# Altium schematic sheet 3 buck.SchDoc
size A4; SheetNumber: 3; SheetTotal: 13
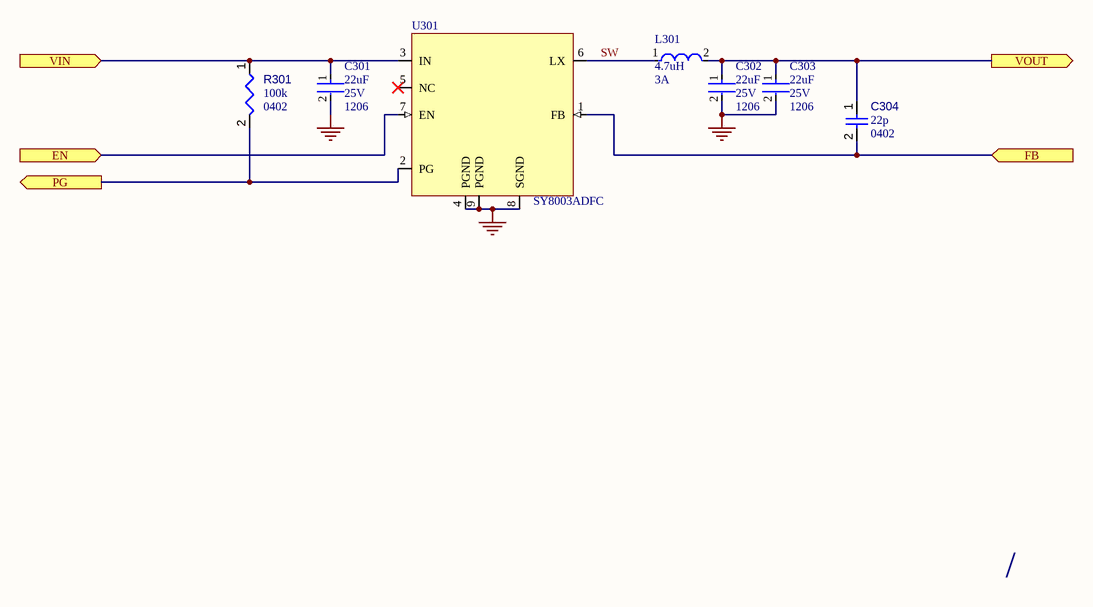
[diagram p0: 3 buck.SchDoc]

## Parts
C301  Capacitance: 22uF  Voltage Rating (DC): 25V  Case Code (Imperial): 1206  [FP-1206-L_3_2_0_3-W_1_6_0-MFG]  (hidden comment: TMK316BBJ226ML-T)
C302  Capacitance: 22uF  Voltage Rating (DC): 25V  Case Code (Imperial): 1206  [FP-1206-L_3_2_0_3-W_1_6_0-MFG]  (hidden comment: TMK316BBJ226ML-T)
C303  Capacitance: 22uF  Voltage Rating (DC): 25V  Case Code (Imperial): 1206  [FP-1206-L_3_2_0_3-W_1_6_0-MFG]  (hidden comment: TMK316BBJ226ML-T)
C304  value 22p  Case/Package: 0402  [CAPC0402(1005)60_L]  (hidden comment: Capacitors,0402,22p)
L301  Inductance: 4.7uH  Current Rating: 3A  [FP-IHLP-2525AH-FP_2_413x3-MFG]  (hidden comment: IHLP2525AHER4R7M01)
R301  value 100k  Case/Package: 0402  [RESC0402(1005)_L]  (hidden comment: Resistors,0402,1%,100k)
U301  SY8003ADFC  [DFN2x2-8]

## Ports
EN (in), FB (in), PG (out), VIN (in), VOUT (out)

## Nets
GND: C301.2 C302.2 C303.2 U301.4(PGND) U301.8(SGND) U301.9(PGND)
EN: U301.7(EN) ; port EN
FB: C304.2 U301.1(FB) ; port FB
PG: R301.2 U301.2(PG) ; port PG
SW: L301.1 U301.6(LX)
VIN: C301.1 R301.1 U301.3(IN) ; port VIN
VOUT: C302.1 C303.1 C304.1 L301.2 ; port VOUT

Not connected (* = marked no-connect by the designer): U301 5(NC)*

## Notes on the sheet
- /

## Library data of the parts
C301-C303 = CMP-14477-000100-2: None; Tolerance: 20%; Dielectric: X5R; Resistor Type: Ceramic; Length: 3.2mm; RoHS Compliant: Yes; Case Code (Metric): 3216; Halogen Free: Halogen Free; Series: M; Termination: SMD/SMT; Voltage Rating: 25V; Packaging: Tape and Reel; Width: 0.063inch; Height: 1.6mm; Thickness: 0.075inch; Min Operating Temperature: -55°C; Case/Package: 1206; Mount: Surface Mount; Max Operating Temperature: 85°C; Weight: 0.000571oz; Construction: Flat; Package Quantity: 2000
C304 = Capacitors: Capacitor; Component Type: Capacitors
L301 = CMP-02424-000390-1: Commercial Inductors, High Saturation Series 4.7uH 3A 78mΩ 20%; Test Frequency: 100kHz; DC Resistance (DCR): 78mR; Saturation Current: 8A; Core Material: Metal; Shielding: Shielded; Self Resonant Frequency: 5MHz; Packaging: Tape and Reel; Height: 1.8mm; Case/Package: 2525; Mount: Surface Mount; Min Operating Temperature: -55°C; Package Quantity: 2000; RMS Current (Irms): 3A; Radiation Hardening: No; Termination: SMD/SMT; Length: 6.86mm; Military Standard: Not; Max DC Current: 8A; Depth: 6.72mm; Height - Seated (Max): 0.071inch; Tolerance: 20%; Lead Free: Lead Free; Inductance Tolerance: 20%; Width: 6.47mm; Max Operating Temperature: 125°C
R301 = Resistors: Resistor; Tolerance: 1%; Component Type: Resistors
U301 = SY8003ADFC: High Efficiency 5.5V, 3A Continuous, 1MHz Synchronous Step Down Regulator; Manufacturer: Silergy; Manufacturer Part Number: High Efficiency 5.5V, 3A continuous, 1MHz; LCSC: C178236